# EAGLE schematic HV-DST (EAGLE 7.5.0)
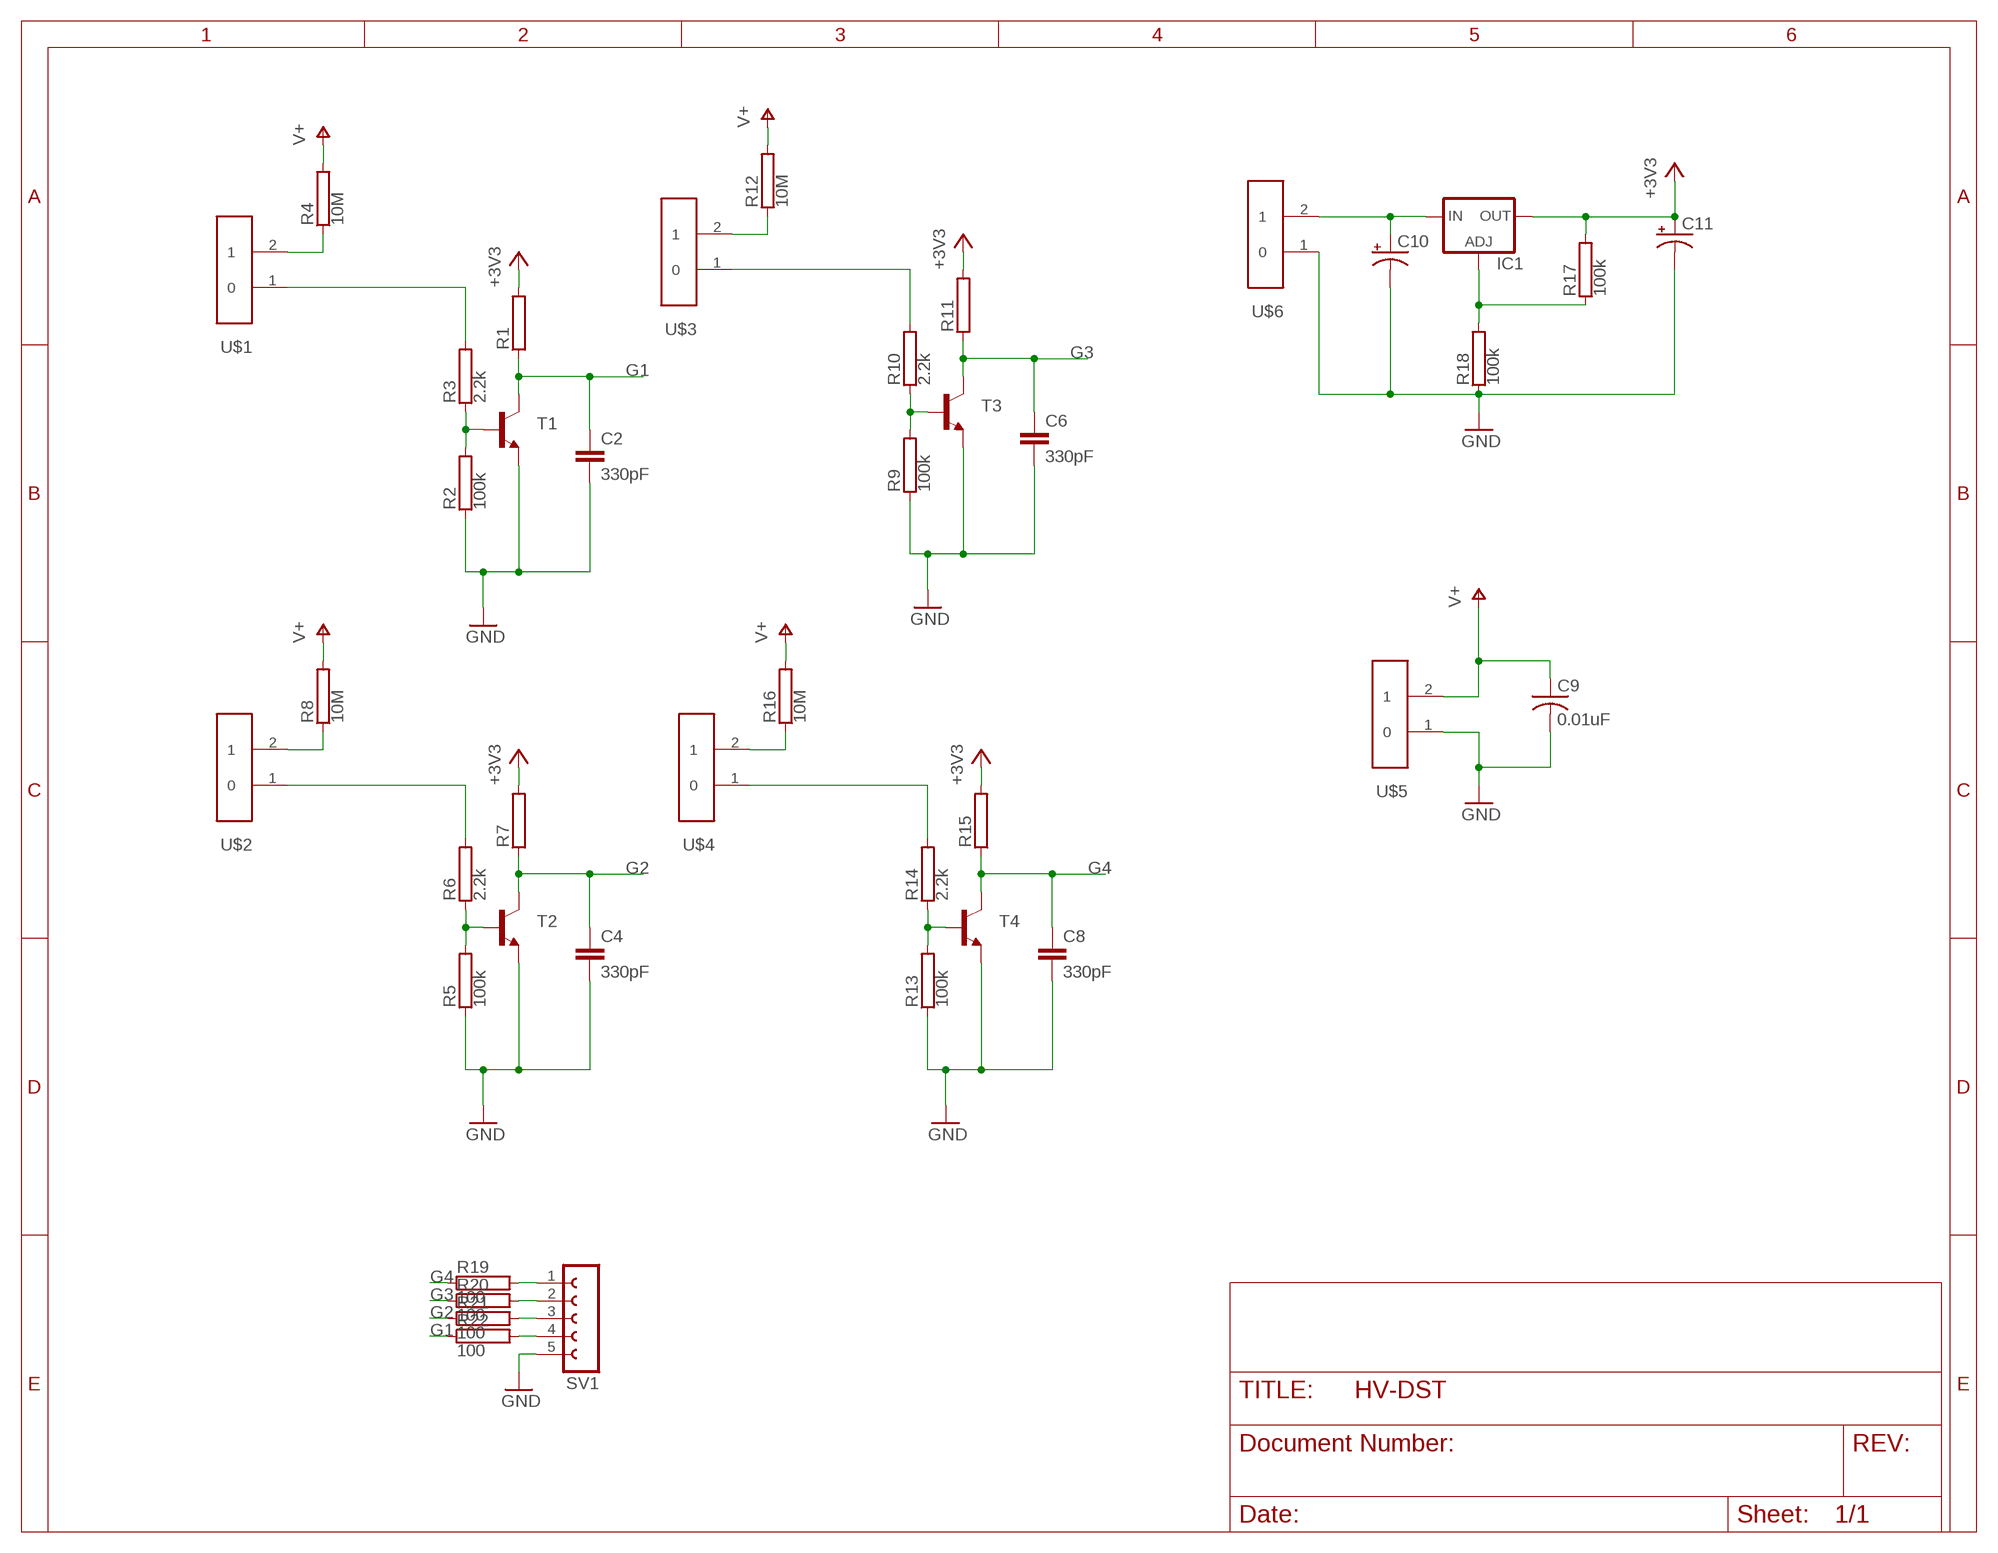
[diagram p0: schematic, sheet 1]

## Parts
C2  330pF  C2.5/2  [C2.5-2]
C4  330pF  C2.5/2  [C2.5-2]
C6  330pF  C2.5/2  [C2.5-2]
C8  330pF  C2.5/2  [C2.5-2]
C9  0.01uF  C-US075-032X103  [C075-032X103]
C10  CPOL-USE2.5-5  [E2,5-5]
C11  CPOL-USE2.5-5  [E2,5-5]
IC1  LM317TS  [317TS]
R1  RRS1/4  [RS1/4]
R2  100k  RRS1/4  [RS1/4]
R3  2.2k  RRS1/4  [RS1/4]
R4  10M  RRS1/4  [RS1/4]
R5  100k  RRS1/4  [RS1/4]
R6  2.2k  RRS1/4  [RS1/4]
R7  RRS1/4  [RS1/4]
R8  10M  RRS1/4  [RS1/4]
R9  100k  RRS1/4  [RS1/4]
R10  2.2k  RRS1/4  [RS1/4]
R11  RRS1/4  [RS1/4]
R12  10M  RRS1/4  [RS1/4]
R13  100k  RRS1/4  [RS1/4]
R14  2.2k  RRS1/4  [RS1/4]
R15  RRS1/4  [RS1/4]
R16  10M  RRS1/4  [RS1/4]
R17  100k  RRS1/4  [RS1/4]
R18  100k  RRS1/4  [RS1/4]
R19  100  RRS1/4  [RS1/4]
R20  100  RRS1/4  [RS1/4]
R21  100  RRS1/4  [RS1/4]
R22  100  RRS1/4  [RS1/4]
SV1  FE05-1  [FE05-1]
T1  2N5551-NPN-TO92-CBE  [TO92-CBE]
T2  2N5551-NPN-TO92-CBE  [TO92-CBE]
T3  2N5551-NPN-TO92-CBE  [TO92-CBE]
T4  2N5551-NPN-TO92-CBE  [TO92-CBE]
U$1  ED2609  [ED2609]
U$2  ED2609  [ED2609]
U$3  ED2609  [ED2609]
U$4  ED2609  [ED2609]
U$5  ED2609  [ED2609]
U$6  ED2609  [ED2609]

## Nets
+3V3: C11.+ IC1.2(OUT) R1.2 R7.2 R11.2 R15.2 R17.2
G1: C2.1 R1.1 R22.1 T1.C
G2: C4.1 R7.1 R21.1 T2.C
G3: C6.1 R11.1 R20.1 T3.C
G4: C8.1 R15.1 R19.1 T4.C
GND: C2.2 C4.2 C6.2 C8.2 C9.2 C10.- C11.- R2.1 R5.1 R9.1 R13.1 R18.1 SV1.5 T1.E T2.E T3.E T4.E U$5.1 U$6.1
N$1: R2.2 R3.1 T1.B
N$2: R3.2 U$1.1
N$3: C10.+ IC1.3(IN) U$6.2
N$4: R4.1 U$1.2
N$5: R5.2 R6.1 T2.B
N$6: R6.2 U$2.1
N$7: R19.2 SV1.1
N$8: R8.1 U$2.2
N$9: R9.2 R10.1 T3.B
N$10: R10.2 U$3.1
N$11: IC1.1(ADJ) R17.1 R18.2
N$12: R12.1 U$3.2
N$13: R13.2 R14.1 T4.B
N$14: R14.2 U$4.1
N$15: R20.2 SV1.2
N$16: R16.1 U$4.2
N$17: R21.2 SV1.3
N$18: R22.2 SV1.4
V+: C9.1 R4.2 R8.2 R12.2 R16.2 U$5.2

## Library data of the parts
C2 C4 C6 C8 = capacitor-wima:C: CAPACITOR naming: grid - package width
C9 = rcl:C-US: CAPACITOR, American symbol
C10 C11 = rcl:CPOL-US: POLARIZED CAPACITOR, American symbol
IC1 = v-reg:LM317TS: VOLTAGE REGULATOR
R1-R22 = resistor-power:R: Power Resitor; MF: OHMITE; MPN: RRS1K0; OC_FARNELL: unknown; OC_NEWARK: 01F7661
SV1 = con-lsta:FE05-1: FEMALE HEADER; OC_FARNELL: unknown; OC_NEWARK: unknown
T1-T4 = transistor:*-NPN-: NPN Transistror BF959 corrected 2008.03.06
U$1-U$6 = muon-tube:ED2609